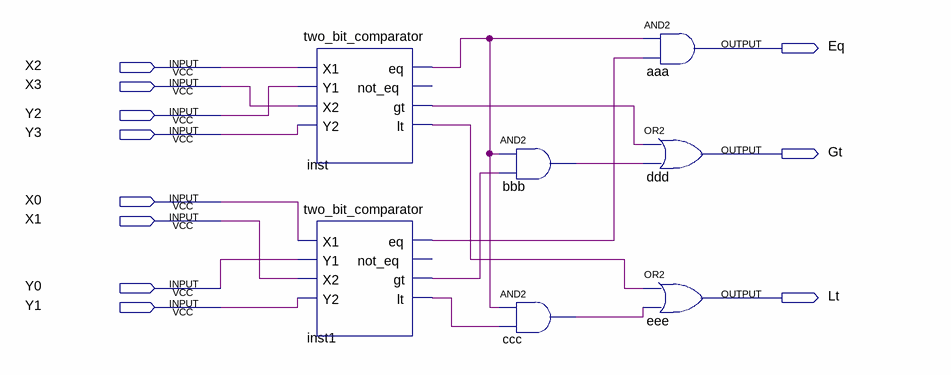
[diagram p0: schematic sheet]
// Quartus schematic assignment_3_3.bdf as structural Verilog: 7 symbols, 11 pins
module assignment_3_3 (
  input  X2,
  input  X3,
  input  Y2,
  input  Y3,
  input  X0,
  input  X1,
  input  Y0,
  input  Y1,
  output Eq,
  output Gt,
  output Lt
);

  wire bbb_out, ccc_out, inst1_eq, inst1_gt, inst1_lt, inst_eq, inst_gt, inst_lt;

  two_bit_comparator inst (
    .X1(X2), .Y1(Y2), .X2(X3), .Y2(Y3), .eq(inst_eq), .gt(inst_gt), .lt(inst_lt));  // open: not_eq
  two_bit_comparator inst1 (
    .X1(X0), .Y1(Y0), .X2(X1), .Y2(Y1), .eq(inst1_eq), .gt(inst1_gt), .lt(inst1_lt));  // open: not_eq
  and bbb (bbb_out, inst_eq, inst1_gt);
  and ccc (ccc_out, inst_eq, inst1_lt);
  and aaa (Eq, inst_eq, inst1_eq);
  or ddd (Gt, inst_gt, bbb_out);
  or eee (Lt, inst_lt, ccc_out);
endmodule
